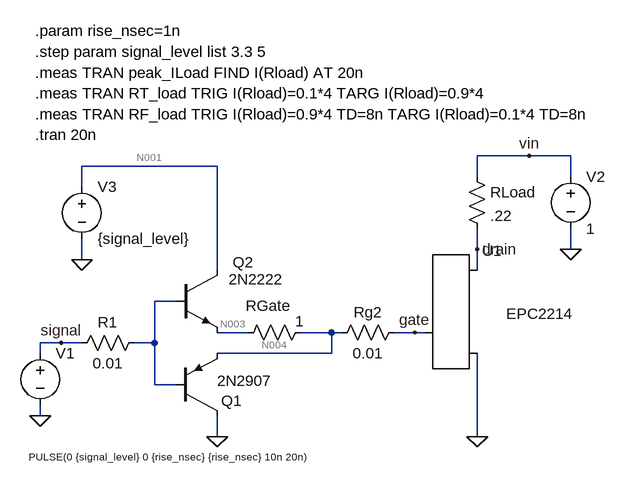
[diagram p0: schematic 03-epc2214.asc]
03-epc2214.asc, the LTspice schematic file:
Version 4
SHEET 1 880 680
WIRE 416 -224 336 -224
WIRE 480 -224 416 -224
WIRE -64 -208 -272 -208
WIRE 336 -192 336 -224
WIRE 480 -192 480 -224
WIRE -272 -176 -272 -208
WIRE 336 -80 336 -112
WIRE 480 -80 480 -112
WIRE -272 -64 -272 -96
WIRE -64 -48 -64 -208
WIRE 336 -48 336 -80
WIRE -128 0 -160 0
WIRE -16 48 -64 48
WIRE 112 48 64 48
WIRE 128 48 112 48
WIRE 240 48 208 48
WIRE 256 48 240 48
WIRE -304 64 -336 64
WIRE -272 64 -304 64
WIRE -160 64 -160 0
WIRE -160 64 -192 64
WIRE -336 80 -336 64
WIRE 112 80 112 48
WIRE 112 80 -64 80
WIRE -160 128 -160 64
WIRE -128 128 -160 128
WIRE -336 176 -336 160
WIRE -64 208 -64 176
WIRE 336 208 336 80
FLAG 336 208 0
FLAG -336 176 0
FLAG 480 -80 0
FLAG 416 -224 vin
FLAG 336 -80 drain
FLAG 240 48 gate
FLAG -304 64 signal
FLAG -272 -64 0
FLAG -64 208 0
SYMBOL EPCGaN 256 48 R0
WINDOW 3 125 -29 Left 2
SYMATTR Value EPC2214
SYMATTR InstName U1
SYMBOL res 80 32 R90
WINDOW 0 -10 65 VBottom 2
WINDOW 3 -17 17 VTop 2
SYMATTR InstName RGate
SYMATTR Value 1
SYMBOL voltage -336 64 R0
WINDOW 3 -18 175 Left 1
WINDOW 123 0 0 Left 0
WINDOW 39 0 0 Left 0
SYMATTR Value PULSE(0 {signal_level} 0 {rise_nsec} {rise_nsec} 10n 20n)
SYMATTR InstName V1
SYMBOL res 320 -208 R0
SYMATTR InstName RLoad
SYMATTR Value .22
SYMBOL voltage 480 -208 R0
WINDOW 123 0 0 Left 0
WINDOW 39 0 0 Left 0
SYMATTR InstName V2
SYMATTR Value 1
SYMBOL pnp -128 176 M180
WINDOW 0 70 23 Left 2
WINDOW 3 64 54 Left 2
SYMATTR InstName Q1
SYMATTR Value 2N2907
SYMBOL npn -128 -48 R0
WINDOW 0 88 -12 Left 2
WINDOW 3 82 14 Left 2
SYMATTR InstName Q2
SYMATTR Value 2N2222
SYMBOL voltage -272 -192 R0
WINDOW 123 0 0 Left 0
WINDOW 39 0 0 Left 0
SYMATTR InstName V3
SYMATTR Value {signal_level}
SYMBOL res -176 48 R90
WINDOW 0 0 56 VBottom 2
WINDOW 3 32 56 VTop 2
SYMATTR InstName R1
SYMATTR Value 0.01
SYMBOL res 224 32 R90
WINDOW 0 0 56 VBottom 2
WINDOW 3 32 56 VTop 2
SYMATTR InstName Rg2
SYMATTR Value 0.01
TEXT -344 -256 Left 2 !.tran 20n
TEXT -344 -416 Left 2 !.param rise_nsec=1n
TEXT -344 -384 Left 2 !.step param signal_level list 3.3 5
TEXT -344 -352 Left 2 !.meas TRAN peak_ILoad FIND I(Rload) AT 20n
TEXT -344 -320 Left 2 !.meas TRAN RT_load TRIG I(Rload)=0.1*4 TARG I(Rload)=0.9*4
TEXT -344 -288 Left 2 !.meas TRAN RF_load TRIG I(Rload)=0.9*4 TD=8n TARG I(Rload)=0.1*4 TD=8n

The netlist it stands for:
* 03-epc2214.asc
XU1 gate drain 0 EPC2214
RGate N004 N003 1
V1 signal 0 PULSE(0 {signal_level} 0 {rise_nsec} {rise_nsec} 10n 20n)
RLoad vin drain .22
V2 vin 0 1
Q1 0 N002 N004 0 2N2907
Q2 N001 N002 N003 0 2N2222
V3 N001 0 {signal_level}
R1 N002 signal 0.01
Rg2 gate N004 0.01
.model NPN NPN
.model PNP PNP
.lib standard.bjt
.tran 20n
.param rise_nsec=1n
.step param signal_level list 3.3 5
.meas TRAN peak_ILoad FIND I(Rload) AT 20n
.meas TRAN RT_load TRIG I(Rload)=0.1*4 TARG I(Rload)=0.9*4
.meas TRAN RF_load TRIG I(Rload)=0.9*4 TD=8n TARG I(Rload)=0.1*4 TD=8n
.backanno
.end

* Results of the author's LTspice run, read from the files saved beside the schematic
* Operating Point (first step), zero values left out:
*   signal_level = 3.3 
*   V(drain) = 1 V
*   V(gate) = 320.3 mV
*   V(n004) = 320.3 mV
*   V(n003) = 320.3 mV
*   V(vin) = 1 V
*   V(n001) = 3.3 V
*   Ic(Q1) = -2.388 nA
*   Ib(Q1) = -9.872 pA
*   Ie(Q1) = 2.398 nA
*   Ic(Q2) = 3.304 pA
*   Ib(Q2) = -3.624 pA
*   I(Rload) = 22.69 nA
*   I(R1) = 13.5 pA
*   I(Rg2) = 2.398 nA
*   I(V1) = 13.5 pA
*   I(V2) = -22.69 nA
*   I(V3) = -3.304 pA
*   Ix(u1:GATEIN) = -2.398 nA
*   Ix(u1:DRAININ) = 22.69 nA
*   Ix(u1:SOURCEIN) = -20.3 nA
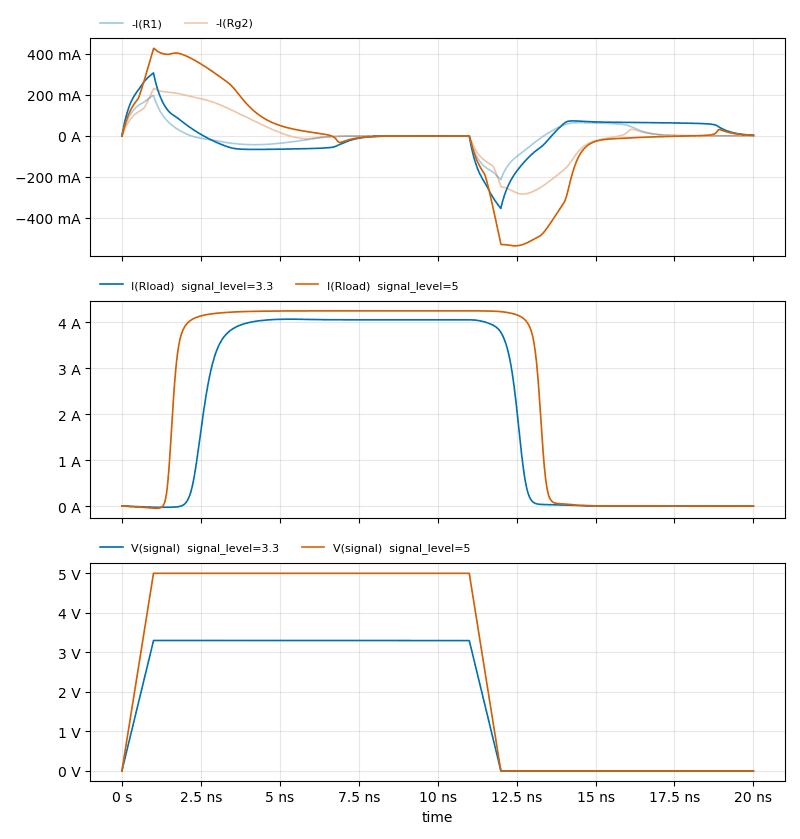
[diagram p1: Transient Analysis of 03-epc2214.asc, plotted from the saved traces]
* Transient Analysis, 2 runs:
*   -I(R1) [signal_level=3.3]: min -213.9 mA, max 197.8 mA, average 157.5 µA, rms 61.92 mA, last 4.159 µA
*   -I(R1) [signal_level=5]: min -354.3 mA, max 306.9 mA, average 367.3 µA, rms 101.7 mA, last 3.003 mA
*   -I(Rg2) [signal_level=3.3]: min -284.1 mA, max 231.3 mA, average -462.2 µA, rms 114.9 mA, last 3.264 µA
*   -I(Rg2) [signal_level=5]: min -536.5 mA, max 427 mA, average -1.581 mA, rms 220.9 mA, last 2.323 mA
*   I(Rload) [signal_level=3.3]: min -28.36 mA, max 4.068 A, average 1.991 A, rms 2.785 A, last -477.3 nA
*   I(Rload) [signal_level=5]: min -50.63 mA, max 4.25 A, average 2.45 A, rms 3.19 A, last -355.9 µA
*   V(signal) [signal_level=3.3]: min 0 V, max 3.3 V, average 1.815 V, rms 2.41 V, last 0 V
*   V(signal) [signal_level=5]: min 0 V, max 5 V, average 2.75 V, rms 3.652 V, last 0 V
* From the log:
*   Measurement: peak_iload
*     step  i(rload)  at
*        1  -4.7731e-07  2e-08
*        2  -0.000355867  2e-08
*   Measurement: rt_load
*     step  rt_load  FROM  TO
*        1  9.32165e-10  2.21766e-09  3.14983e-09
*        2  3.94314e-10  1.43507e-09  1.82938e-09
*   Measurement: rf_load
*     step  rf_load  FROM  TO
*        1  6.90103e-10  1.21263e-08  1.28164e-08
*        2  4.21799e-10  1.30374e-08  1.34592e-08